# EAGLE design plc_esp32_programmer (EAGLE 9.6.2)
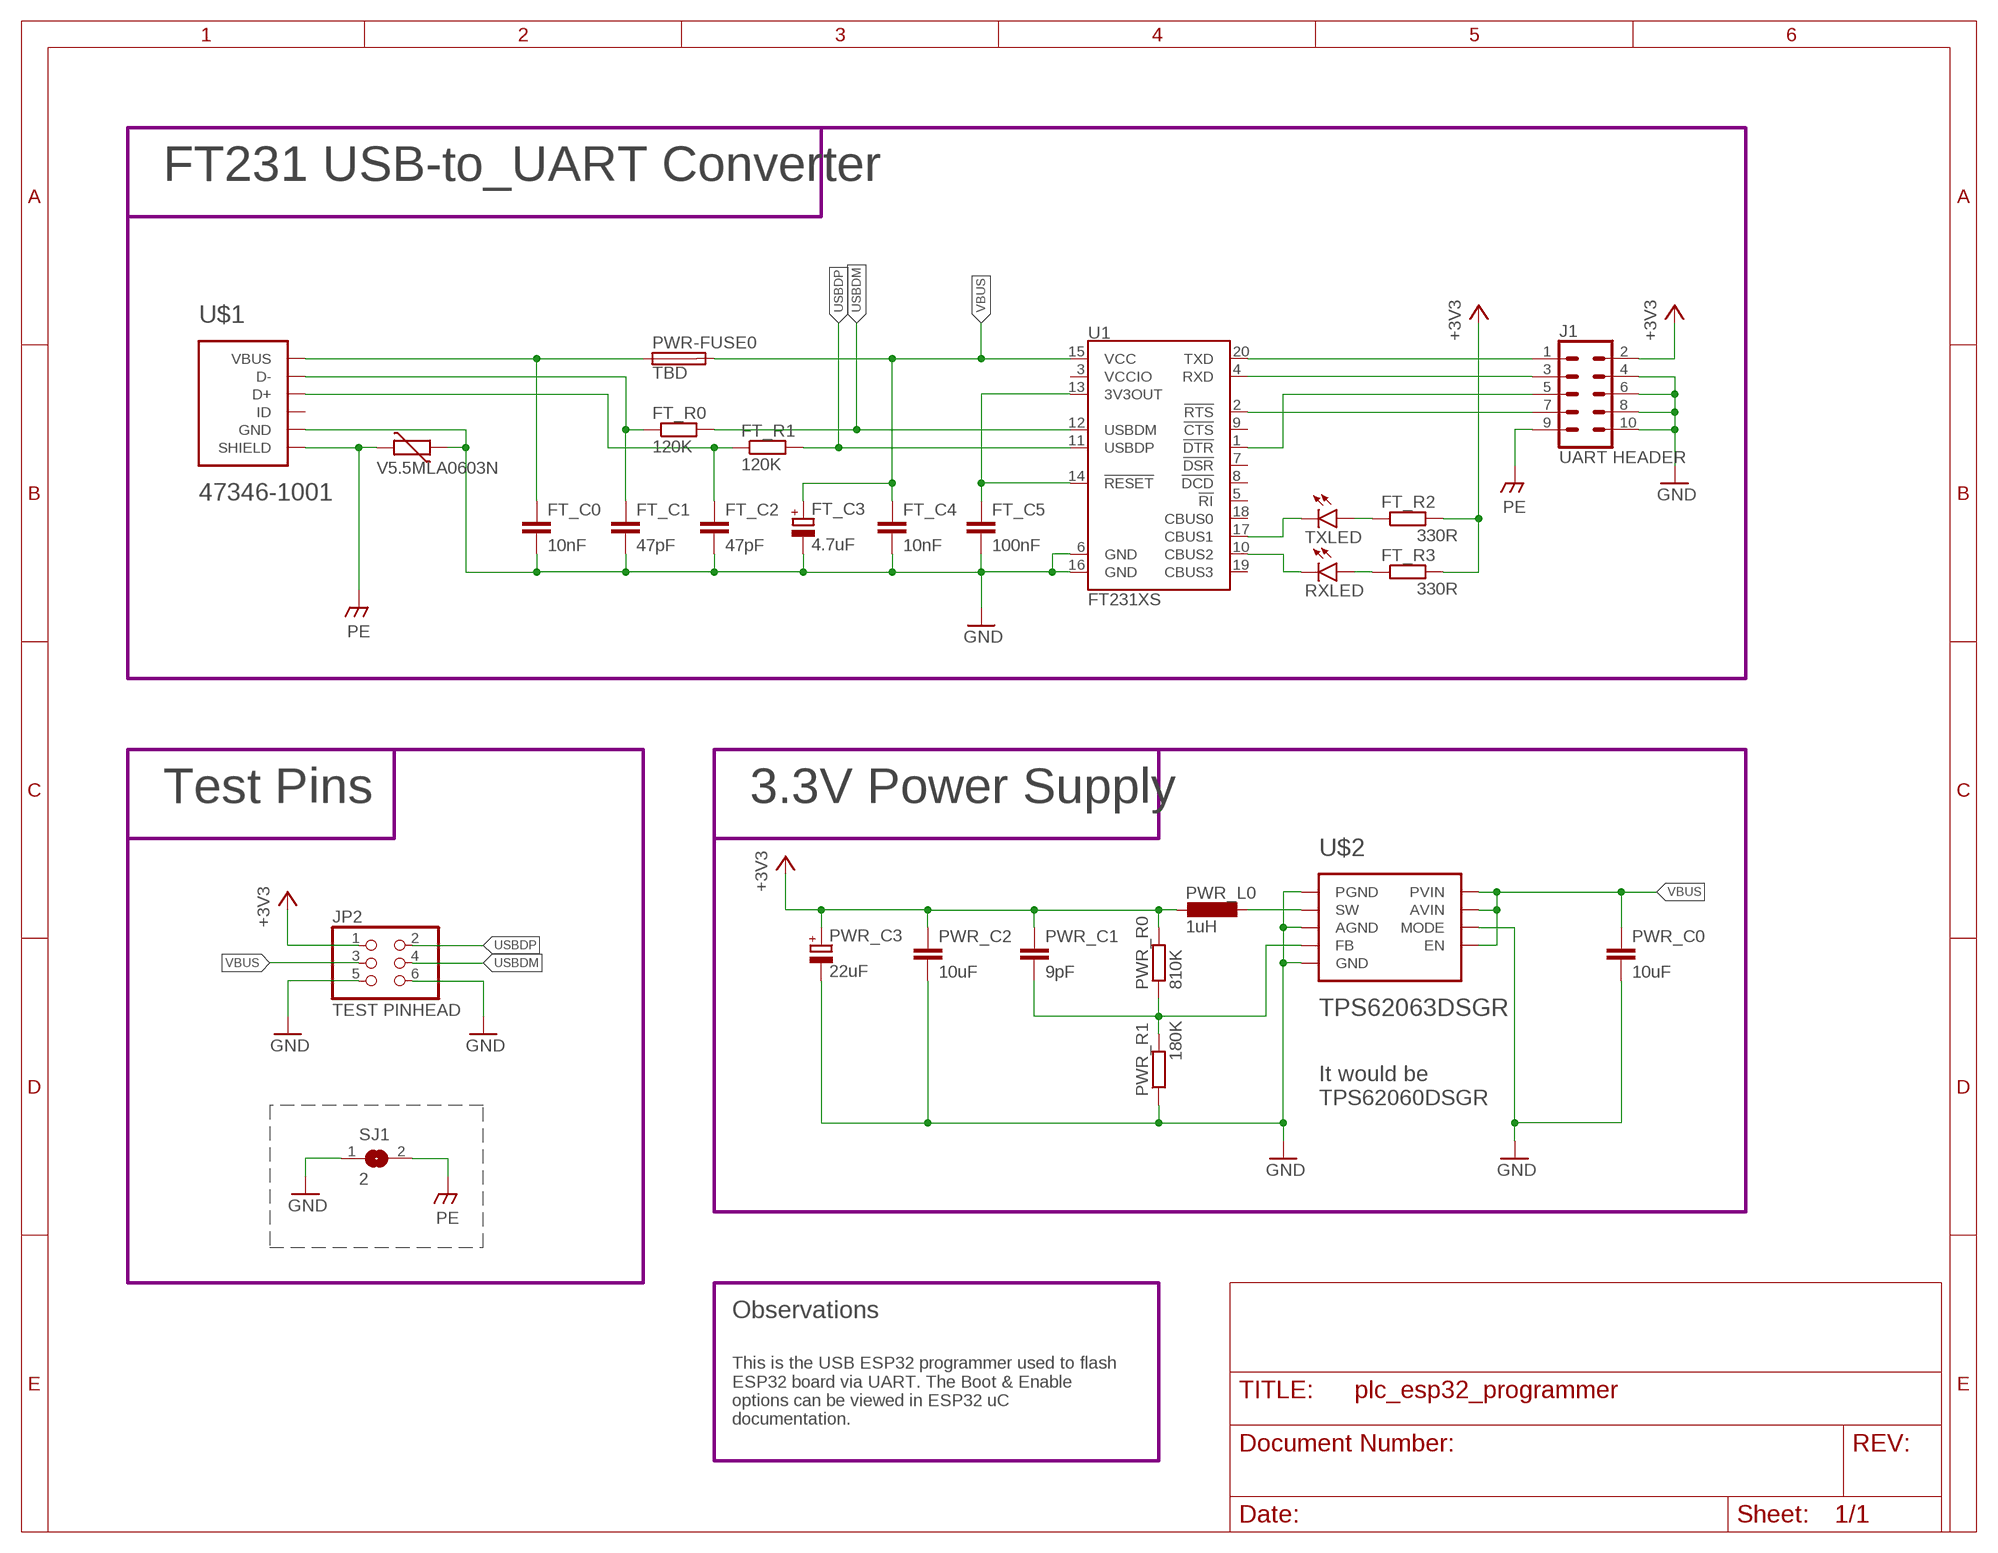
[diagram p0: schematic, sheet 1]

## Parts
FT_C0  10nF  C-EUC0402  [C0402]
FT_C1  47pF  C-EUC0402  [C0402]
FT_C2  47pF  C-EUC0402  [C0402]
FT_C3  4.7uF  CPOL-EUSMCB  [SMC_B]
FT_C4  10nF  C-EUC0402  [C0402]
FT_C5  100nF  C-EUC0402  [C0402]
FT_R0  120K  R-EU_R0402  [R0402]
FT_R1  120K  R-EU_R0402  [R0402]
FT_R2  330R  R-EU_R0402  [R0402]
FT_R3  330R  R-EU_R0402  [R0402]
J1  UART HEADER  CONN_05X2SHD_SMD  [2X5-SHROUDED_SMD]
JP2  TEST PINHEAD  PINHD-2X3  [2X03]
MCU_VAR1  V5.5MLA0603N  VARISTORCN0603  [CT/CN0603]
PWR-FUSE0  TBD  MF-SMDF050  [MF-SMDF050]
PWR_C0  10uF  C-EUC0603  [C0603]
PWR_C1  9pF  C-EUC0402  [C0402]
PWR_C2  10uF  C-EUC0603  [C0603]
PWR_C3  22uF  CPOL-EUSMCB  [SMC_B]
PWR_L0  1uH  L-EUL1210  [L1210]
PWR_R0  810K  R-EU_R0402  [R0402]
PWR_R1  180K  R-EU_R0402  [R0402]
RXLED  LG_T679-E1F1-1  [PLCC2]
SJ1  2  SJ  [SJ]
TXLED  LG_T679-E1F1-1  [PLCC2]
U1  FT231XS  [SSOP20_L]
U$1  47346-1001  [47346-1001]
U$2  TPS62063DSGR  [WSON-8]

## Nets
+3V3: FT_R2.2 FT_R3.2 J1.2 JP2.1 PWR_C1.1 PWR_C2.1 PWR_C3.+ PWR_L0.2 PWR_R0.2
GND: FT_C0.2 FT_C1.2 FT_C2.2 FT_C3.- FT_C4.2 FT_C5.2 J1.4 J1.6 J1.8 J1.10 JP2.5 JP2.6 MCU_VAR1.1 PWR_C0.2 PWR_C2.2 PWR_C3.- PWR_R1.1 SJ1.1 U1.6(GND) U1.16(GND) U$1.5(GND) U$2.1(PGND) U$2.3(AGND) U$2.6(MODE) U$2.9(GND) U$2.10(GND) U$2.11(GND)
N$1: J1.1 U1.20(TXD)
N$2: J1.3 U1.4(RXD)
N$3: J1.7 U1.2(!RTS)
N$4: J1.5 U1.1(!DTR)
N$5: FT_C5.1 U1.13(3V3OUT) U1.14(!RESET)
N$6: FT_C2.1 FT_R1.1 U$1.3(D+)
N$7: FT_C1.1 FT_R0.1 U$1.2(D-)
N$8: FT_C0.1 PWR-FUSE0.1 U$1.1(VBUS)
N$9: FT_R3.1 RXLED.A
N$10: RXLED.C U1.10(CBUS2)
N$11: PWR_L0.1 U$2.2(SW)
N$12: PWR_C1.2 PWR_R0.1 PWR_R1.2 U$2.4(FB)
N$22: FT_R2.1 TXLED.A
N$27: TXLED.C U1.17(CBUS1)
PE: J1.9 MCU_VAR1.2 SJ1.2 U$1.6(SHIELD) U$1.7(SHIELD) U$1.8(SHIELD) U$1.9(SHIELD) U$1.10(SHIELD) U$1.11(SHIELD)
USBDM: FT_R0.2 JP2.4 U1.12(USBDM)
USBDP: FT_R1.2 JP2.2 U1.11(USBDP)
VBUS: FT_C3.+ FT_C4.1 JP2.3 PWR-FUSE0.2 PWR_C0.1 U1.15(VCC) U$2.5(EN) U$2.7(AVIN) U$2.8(PVIN)
Unconnected: U1.3(VCCIO) U1.5(!RI) U1.7(!DSR) U1.8(!DCD) U1.9(!CTS) U1.18(CBUS0) U1.19(CBUS3) U$1.4(ID)

## Notes on the sheet
- FT231 USB-to_UART Converter
- Test Pins | 3.3V Power Supply
- It would be
  TPS62060DSGR
- Observations
- This is the USB ESP32 programmer used to flash
  ESP32 board via UART. The Boot & Enable
  options can be viewed in ESP32 uC
  documentation.

## Library data of the parts
FT_C0 FT_C1 FT_C2 FT_C4 FT_C5 PWR_C0 PWR_C1 PWR_C2 = rcl:C-EU: CAPACITOR, European symbol; SPICEPREFIX: C
FT_C3 PWR_C3 = rcl:CPOL-EU: POLARIZED CAPACITOR, European symbol; SPICEPREFIX: C
FT_R0 FT_R1-FT_R3 PWR_R0 PWR_R1 = rcl:R-EU_: RESISTOR, European symbol; SPICEPREFIX: R
J1 = SparkFun-Connectors:CONN_05X2: Multi connection point. Often used as Generic Header-pin footprint for 0.1 inch spaced/style header connections For AVR SPI programming port, see special device with nice symbol: "AVR_SPI_PROG_5x2.dev" You can populate with any combo of single row headers, but if you'd like an exact match, check these: 2x5 AVR ICSP Male Header <https://www.sparkfun.com/products/778> (PRT-00778) 2x5 Pin Shrouded Header <https://www.sparkfun.com/products/8506> (PRT-08506) On any of the 0.1 inch spaced packages, you can populate with these: Break Away Headers - Straight <https://www.sparkfun.com/products/116> (PRT-00116) Break Away Male Headers - Right Angle <https://www.sparkfun.com/products/553> (PRT-00553) Female Headers <https://www.sparkfun.com/products/115> (PRT-00115) Break Away Headers - Machine Pin <https://www.sparkfun.com/products/117> (PRT-00117) Break Away Female Headers - Swiss Machine Pin <https://www.sparkfun.com/products/743> (PRT-00743) Special note: the shrouded connector mates well with our 5x2 ribbon cables: 2x5 Pin IDC Ribbon Cable <https://www.sparkfun.com/products/8535> (PRT-08535); PROD_ID: CONN-09508
JP2 = pinhead:PINHD-2X3: PIN HEADER
MCU_VAR1 = varistor:VARISTOR: VARISTOR
PWR-FUSE0 = fuse:MF-SMDF: MF-SMDF Series - PRC Resettable Fuses Source: http://www.farnell.com/datasheets/716597.pdf
PWR_L0 = rcl:L-EU: INDUCTOR, European symbol
RXLED TXLED = led:*_T679-?-1: LC TOPLED® Low Current LED Source: http://catalog.osram-os.com .. LG_LS_LY_T679_OBS.pdf; COLOR: green
SJ1 = jumper:SJ: SMD solder JUMPER
U1 = SparkFun-IC-Comms:FT231X: FTDI FT231X Full Speed USB to Full-handshake UART This USB2.0 Full Speed IC offers a compact bridge to full handshake UART interfaces. The device is a UART, capable of operating up to 3MBaud, with low power consumption (8mA). The FT231X includes the complete FT-X series feature set and enables USB to be added into a system design quickly and easily over a UART interface. Datasheet <http://cdn.sparkfun.com/datasheets/Components/General%20IC/DS_FT231X.pdf> SparkFun Products SparkFun RedBoard - Programmed with Arduino <https://www.sparkfun.com/products/12757> (DEV-12757) SparkFun XBee Explorer USB <https://www.sparkfun.com/products/11812> (WRL-11812) SparkFun XBee Explorer Dongle <https://www.sparkfun.com/products/11697> (WRL-11697) SparkFun Blynk Board - ESP8266 <https://www.sparkfun.com/products/13794> (WRL-13794) SparkFun ESP8266 Thing - Dev Board <https://www.sparkfun.com/products/13711> (WRL-13711) SparkFun Block for Intel® Edison - Base <https://www.sparkfun.com/products/13045> (DEV-13045) SparkFun RedStick <https://www.sparkfun.com/products/13741> (DEV-13741) SparkFun Beefy 3 - FTDI Basic Breakout <https://www.sparkfun.com/products/13746> (DEV-13746) SparkFun FT231X Breakout <https://www.sparkfun.com/products/11736> (BOB-11736); PROD_ID: IC-11524
U$1 = my-Molex:47346-1001
U$2 = my-TexasInstruments:TPS62063DSGR

## Board
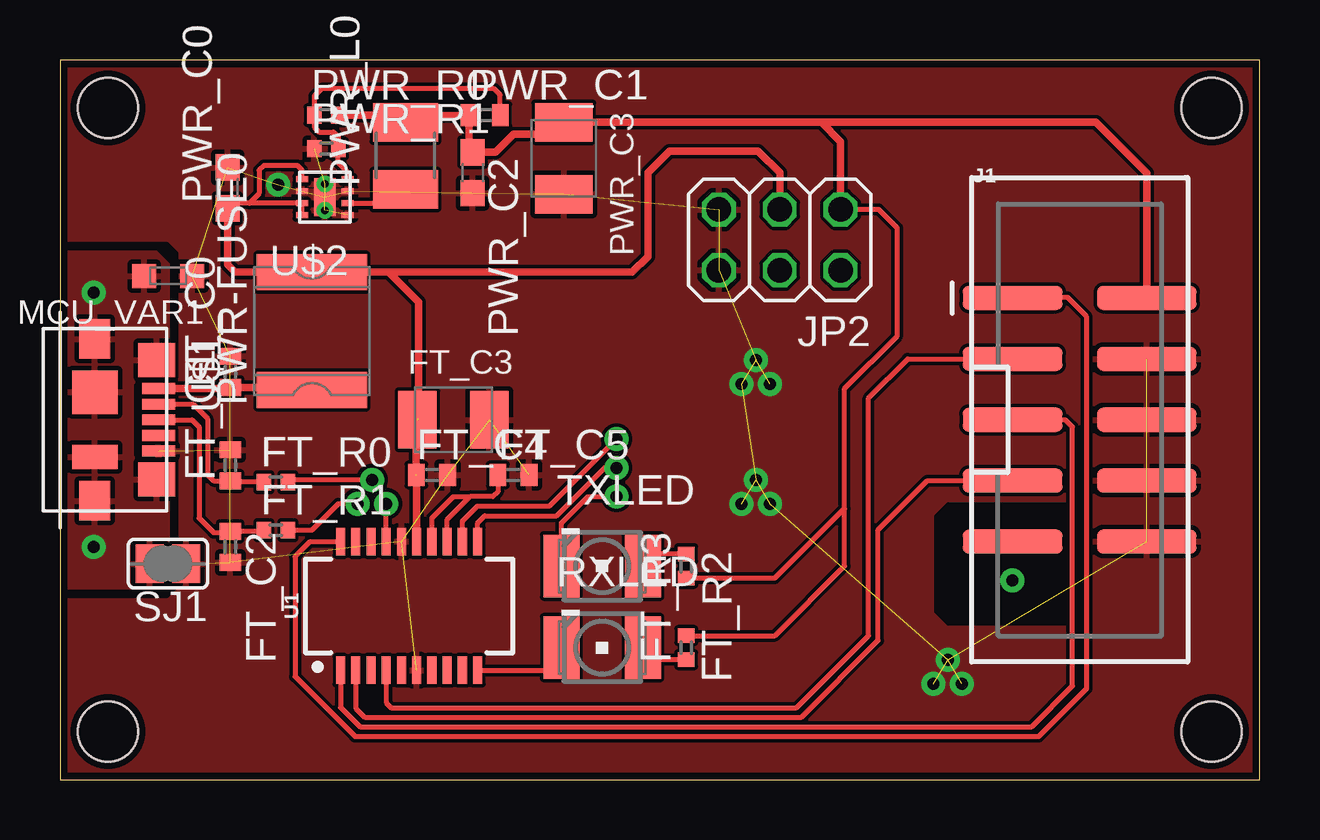
[diagram p1: board, top side]
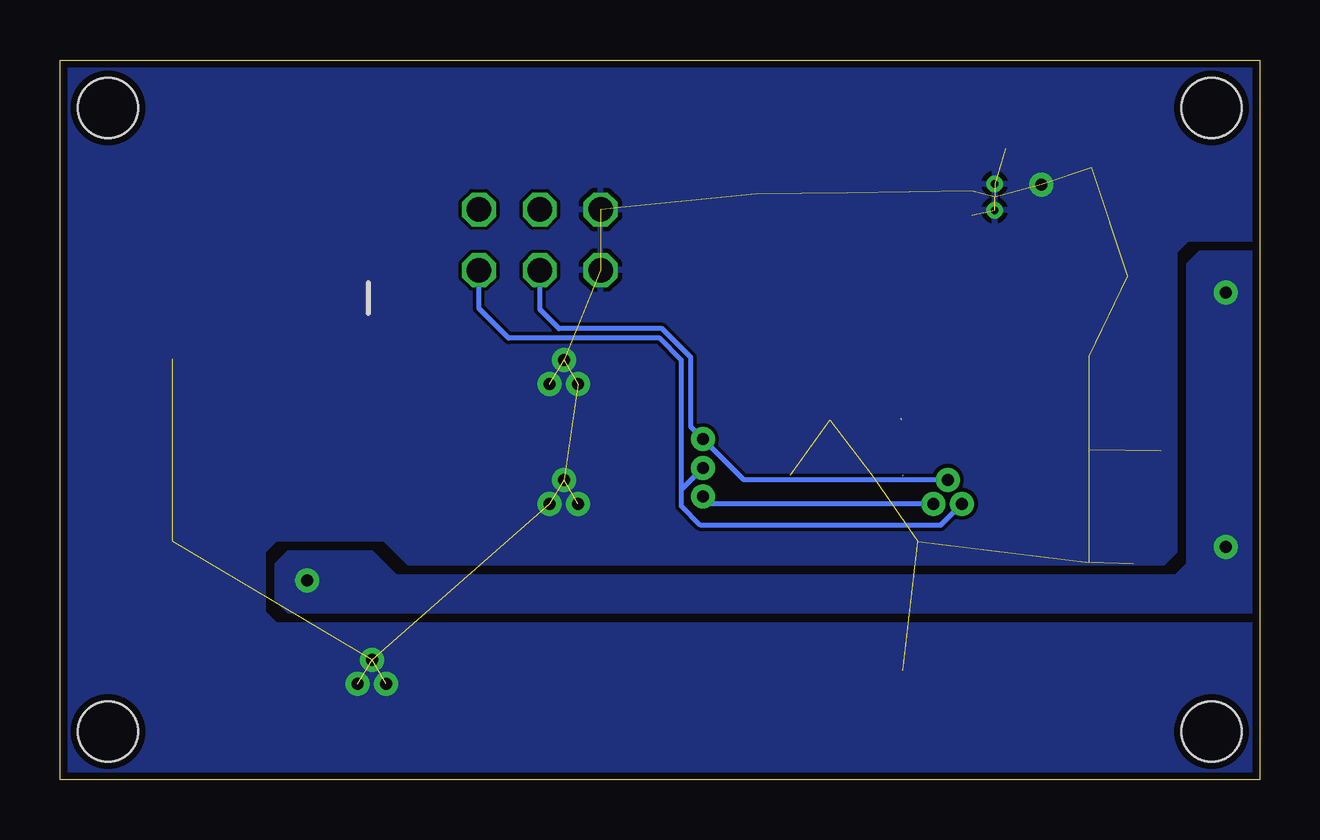
[diagram p2: board, bottom side, seen from below]

Size 50 x 30 mm. Coordinates in mm from the lower left corner, seen from the top.
Outline: 0,0 50,0 50,30 0,30 0,0
Copper layers (1*16): Top 0.035mm / dielectric 1.5mm / Bottom 0.035mm
Design rules "PCB-POOL Standard": minimum track width 0.15mm, minimum drill 0.3mm, track to track 0.15mm, track to pad 0.15mm, pad to pad 0.15mm, via to via 0.15mm, smd to smd 0.15mm, copper to edge 0.3mm, drill to drill 0.2mm, minimum pad ring 0.2mm, minimum via ring 0.15mm, stop-mask expansion 0.03mm, vias tented up to drill 0mil, thermal gap 0.2mm
Holes 2.5 mm at 2,28 2,2 48,28 48,2

### Footprints (pad centres in the part's own frame; a part is rotated, then mirrored left to right if it is on the bottom)
C0402 = smd 0.7 x 0.9: 1 -0.65,0; 2 0.65,0
SMC_B = smd 1.6 x 2.4: + -1.5,0; - 1.5,0
R0402 = smd 0.6 x 0.7: 1 -0.5,0; 2 0.5,0
2X5-SHROUDED_SMD = smd 4.15 x 1: 1 -2.794,5.08; 2 2.794,5.08; 3 -2.794,2.54; 4 2.794,2.54; 5 -2.794,0; 6 2.794,0; 7 -2.794,-2.54; 8 2.794,-2.54; 9 -2.794,-5.08; 10 2.794,-5.08
2X03 = drill 1.016 octagon: 1 -2.54,-1.27; 2 -2.54,1.27; 3 0,-1.27; 4 0,1.27; 5 2.54,-1.27; 6 2.54,1.27
CT/CN0603 = smd 1 x 1: 1 -1,0; 2 1,0
MF-SMDF050 = smd 1.5 x 4.6: 1 -2.45,0; 2 2.45,0
C0603 = smd 1.1 x 1: 1 -0.85,0; 2 0.85,0
L1210 = smd 1.6 x 2.7: 1 -1.4,0; 2 1.4,0
PLCC2 = smd 2.6 x 1.5: A 0,1.7; C 0,-1.7
SJ = smd 1.168 x 1.6: 1 -0.762,0; 2 0.762,0
SSOP20_L = smd 0.381 x 1.143: 1 -2.857,-2.68; 2 -2.223,-2.68; 3 -1.587,-2.68; 4 -0.953,-2.68; 5 -0.318,-2.68; 6 0.318,-2.68; 7 0.953,-2.68; 8 1.587,-2.68; 9 2.223,-2.68; 10 2.857,-2.68; 11 2.857,2.68; 12 2.223,2.68; 13 1.587,2.68; 14 0.953,2.68; 15 0.318,2.68; 16 -0.318,2.68; 17 -0.953,2.68; 18 -1.587,2.68; 19 -2.223,2.68; 20 -2.857,2.68
47346-1001 = smd 0.45 x 1.38: 1 -1.3,2.66; 2 -0.65,2.66; 3 0,2.66; 4 0.65,2.66; 5 1.3,2.66 | smd 1.425 x 1.55: 6 -2.487,2.575; 7 2.487,2.575 | smd 1.65 x 1.3: 8 -3.375,0; 11 3.375,0 | smd 1.8 x 1.9: 9 -1.15,0 | smd 1 x 1.9: 10 1.55,0
WSON-8 = smd 0.5 x 0.25: 1 -0.95,0.75; 2 -0.95,0.25; 3 -0.95,-0.25; 4 -0.95,-0.75; 5 0.95,-0.75; 6 0.95,-0.25; 7 0.95,0.25; 8 0.95,0.75 | smd 0.9 x 1.6: 9 0,0 | drill 0.3 pad 0.406: 10 0,0.55; 11 0,-0.55

### Placement (x,y rotation side)
FT_C0  7.1,17 90 top
FT_C1  7.1,13.1 90 top
FT_C2  7.1,9.7 270 top
FT_C3  16.4,15 0 top
FT_C4  15.5,12.7 0 top
FT_C5  18.9,12.7 0 top
FT_R0  9,12.4 0 top
FT_R1  9,10.4 0 top
FT_R2  26.1,8.9 270 top
FT_R3  26.1,5.5 90 top
J1  42.5,15 0 top
JP2  30,22.5 180 top
MCU_VAR1  4.5,21 180 top
PWR-FUSE0  10.5,18.7 90 top
PWR_C0  6.98,24.67 90 top
PWR_C1  17.7,27.7 0 top
PWR_C2  17.2,25.3 270 top
PWR_C3  21,25.9 270 top
PWR_L0  14.4,26 90 top
PWR_R0  11.1,27.7 0 top
PWR_R1  11.1,26.3 0 top
RXLED  22.6,5.5 270 top
SJ1  4.5,9 180 top
TXLED  22.6,8.9 270 top
U1  14.55,7.24 0 top
U$1  1.45,15 270 top
U$2  11.04,24.28 180 top

### Tracks (layer width: path | path; a pad name or v marks a point on that pad's centre or on a via)
+3V3
  Top 0.203: FT_R2.2 29.8,8.4 32.7,11.3 | FT_R3.2 29.8,6 32.7,8.9 32.7,11.3 | 32.7,11.3 32.7,16.3 34.9,18.5 34.9,23 34.13,23.77 JP2.1
  Top 0.305: 14.68,27.68 17.03,27.68 PWR_C1.1 17.05,26.3 PWR_C2.1 18.15,26.15 18.9,26.9 20.5,26.9 PWR_C3.+ 31.74,27.4 | 14.68,27.68 PWR_L0.2 | PWR_R0.2 14.66,27.7 14.68,27.68 | 31.74,27.4 32.54,26.6 JP2.1 | J1.2 45.29,25.28 43.17,27.4 31.74,27.4
GND  (via drill 0.5 pad 1)  (36 unrouted)
  other vias: 9.1,24.8 29,17.5 28.4,16.5 29.6,16.5 29,12.5 28.4,11.5 29.6,11.5 37,5 36.4,4 37.6,4
  pour Bottom: 0,22.5 0,30 50,30 50,0 0,0 0,6.5 41,6.5 41.5,7 41.5,9.5 41,10 36.5,10 35.5,9 4,9 3.5,9.5 3.5,22 3,22.5
  pour Top: 0,30 50,30 50,0 0,0 0,7.5 4.5,7.5 5,8 5,13 4.5,13.5 4,13.5 3.5,14 3.5,16 4,16.5 4.5,16.5 5,17 5,22 4.5,22.5 0,22.5
  cutout Top: 37,11.5 42,11.5 42.5,11 42.5,7 42,6.5 37,6.5 36.5,7 36.5,11
N$1
  Top 0.203: U1.20 11.67,9.9 10.4,9.9 9.8,9.3 9.8,4.3 12.3,1.8 40.8,1.8 42.8,3.8 42.8,19.3 42,20.1 39.73,20.1 J1.1
N$2
  Top 0.203: U1.4 13.6,3.2 13.8,3 30.7,3 33.7,6 33.7,15.9 35.34,17.54 J1.3
N$3
  Top 0.203: U1.2 12.33,2.97 12.7,2.6 30.9,2.6 34.1,5.8 34.1,10.4 36.16,12.46 J1.7
N$4
  Top 0.203: U1.1 11.69,3.01 12.5,2.2 40.5,2.2 42.2,3.9 42.2,14.7 41.9,15 J1.5
N$5
  Top 0.203: U1.13 16.14,10.84 17.1,11.8 | U1.14 15.5,10.9 16.4,11.8 17.1,11.8 | FT_C5.1 18.25,12 18.05,11.8 17.1,11.8
N$6
  Top 0.203: U$1.3 5.5,15 5.8,14.7 5.8,10.9 6.4,10.3 7.05,10.3 FT_C2.1 8.45,10.35 FT_R1.1
N$7
  Top 0.203: U$1.2 5.55,15.65 6.16,15.04 6.16,12.69 6.4,12.45 FT_C1.1 7.15,12.4 FT_R0.1
N$8
  Top 0.305: PWR-FUSE0.1 10.4,16.35 FT_C0.1 7.05,16.3 U$1.1
N$9
  Top 0.203: FT_R3.1 24.8,5 RXLED.A
N$10
  Top 0.203: U1.10 20.9,4.56 RXLED.C
N$11
  Top 0.203: U$2.2 13.83,24.03 PWR_L0.1
N$12
  Top 0.203: U$2.4 11.99,25.33 11.6,25.72 PWR_R1.2 11.6,26.8 11.4,27 10.8,27 10.6,27.2 PWR_R0.1 10.6,28.5 10.9,28.8 18.1,28.8 18.35,28.55 PWR_C1.2
N$22
  Top 0.203: FT_R2.1 24.8,9.4 TXLED.A
N$27  (via drill 0.5 pad 1)
  Top 0.203: U1.17 v13.6,11.5 | TXLED.C 20.9,10.7 22,11.8 v23.2,11.8
  Bottom 0.203: v13.6,11.5 22.9,11.5 v23.2,11.8
PE  (via drill 0.5 pad 1)
  other vias: 1.4,20.3 1.4,9.7 39.7,8.3
  pour Top: 0,22 4,22 4.5,21.5 4.5,17.5 4,17 3.5,17 3,16.5 3,13.5 3.5,13 4,13 4.5,12.5 4.5,8.5 4,8 0,8
  pour Top: 37.5,11 37,10.5 37,7.5 37.5,7 41.5,7 42,7.5 42,10.5 41.5,11
  pour Bottom: 0,22 2.5,22 3,21.5 3,9 3.5,8.5 36,8.5 37,9.5 40.5,9.5 41,9 41,7.5 40.5,7 0,7
USBDM  (via drill 0.5 pad 1)
  Top 0.203: U1.12 16.77,10.77 17.4,11.4 20.4,11.4 v23.2,14.2 | v13,12.5 9.6,12.5 FT_R0.2
  Bottom 0.203: v13,12.5 21.5,12.5 v23.2,14.2 23.7,14.7 23.7,17.6 24.9,18.8 29.2,18.8 30,19.6 JP2.4
USBDP  (via drill 0.5 pad 1)
  Top 0.203: U1.11 17.41,10.71 17.7,11 20.7,11 22.7,13 v23.2,13 | v12.4,11.5 11.6,11.5 10.5,10.4 FT_R1.2
  Bottom 0.203: v12.4,11.5 13.3,10.6 23.3,10.6 24.1,11.4 24.1,12.1 | 24.1,12.1 v23.2,13 | 24.1,12.1 24.1,17.5 25,18.4 31.3,18.4 32.54,19.64 JP2.2
VBUS  (2 unrouted)
  Top 0.203: 7.9,24.03 U$2.7 U$2.8 | 7.9,24.03 7.19,24.03 PWR_C0.1 | U$2.5 10.09,25.41 9.9,25.6 8.5,25.6 8.3,25.4 8.3,24.43 7.9,24.03
  Top 0.305: U1.15 14.87,12.68 | PWR_C0.1 6.98,21.47 7.3,21.15 PWR-FUSE0.2 13.7,21.15 | 13.7,21.15 14.95,19.9 14.95,15.05 | 13.7,21.15 23.85,21.15 24.5,21.8 24.5,25.3 25.4,26.2 29.1,26.2 30,25.3 JP2.3 | FT_C4.1 14.85,14.95 FT_C3.+